# Altium schematic sheet reg_bats.SchDoc
size A4
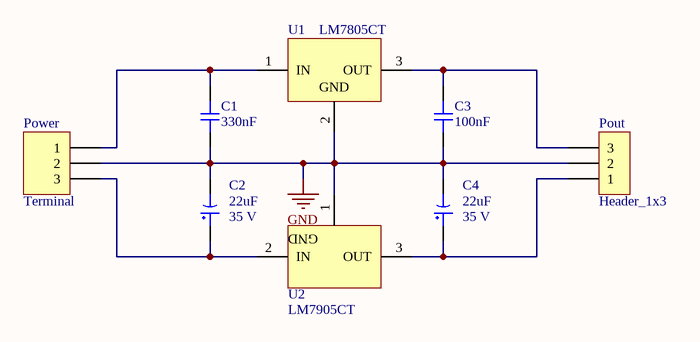
[diagram p0: reg_bats.SchDoc]

## Parts
C1  330nF  [C400-550-150]
C2  22uF  Voltage: 35 V  [CP-RAD-4.0mm-7.0mm-1.5mm]
C3  100nF  [C200-350-150]
C4  22uF  Voltage: 35 V  [CP-RAD-4.0mm-7.0mm-1.5mm]
Pout  Header_1x3  [HDR-M-1x3-2.54mm-180-9.2mm]
Power  Terminal  [KRE_3]
U1  LM7805CT  [TO-220/123]
U2  LM7905CT  [TO-220/123]

## Nets
GND: C1.1 C2.2 C3.1 C4.2 Pout.2 Power.2 U1.2(GND) U2.1(GND)
NetC1_2: C1.2 Power.1 U1.1(IN)
NetC2_1: C2.1 Power.3 U2.2(IN)
NetC3_2: C3.2 Pout.3 U1.3(OUT)
NetC4_1: C4.1 Pout.1 U2.3(OUT)

## Library data of the parts
C1 C3 = Capacitor: Voltage: 100 V; Published: 8-Jun-2000; LatestRevisionDate: 17-Jul-2002; LatestRevisionNote: Re-released for DXP Platform.; PackageReference: RAD-0.3; Publisher: Altium Limited
C2 C4 = Capacitor-Electrolytic: Electrolytic Capacitor
Pout = Header_1x3: Header, 1 Line, 3 Columns, 3 Pins; LatestRevisionDate: 17-Jul-2002; LatestRevisionNote: Re-released for DXP Platform.; Publisher: Altium Limited
Power = KRE_3: Terminal Block 1x3
U1 = LM7805CT: 3-Terminal 1 A Positive 5 V Voltage Regulator
U2 = LM7905CT: 3-Terminal 1 A Negative 5 V Voltage Regulator